# Altium project PCB_Project_3.PrjPcb
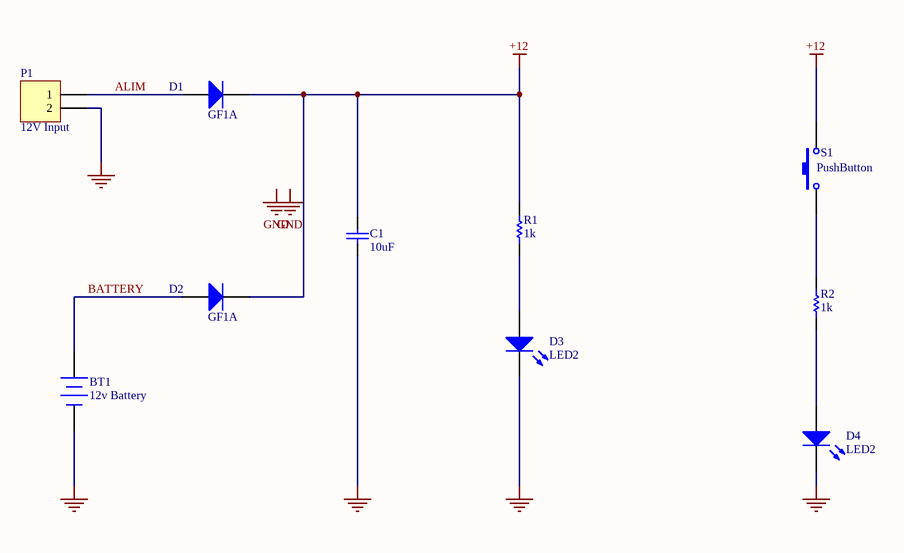
[diagram p0: dechire.SchDoc]
1 sheet, 10 parts. Net scope: global (net labels, ports and power ports of the same name join across sheets).

## Sheet dechire.SchDoc
size A

### Parts
BT1  12v Battery  [BAT-2]
C1  10uF  [RAD-0.3]
D1  GF1A  [SMC]
D2  GF1A  [SMC]
D3  LED2  [LED-1]
D4  LED2  [LED-1]
P1  12V Input  [HDR1X2]
R1  1k  [AXIAL-0.3]
R2  1k  [AXIAL-0.3]
S1  PushButton  [SPST-2]

### Nets
+12: C1.2 D1.2(K) D2.2(K) R1.2 S1.2
GND: BT1.2(-) C1.1 D3.2(K) D4.2(K) P1.2
ALIM: D1.1(A) P1.1
BATTERY: BT1.1(+) D2.1(A)
NetD3_1: D3.1(A) R1.1
NetD4_1: D4.1(A) R2.1
NetR2_2: R2.2 S1.1

### Notes on the sheet
- Labels drawn without touching a wire or pin: GND

### Library data of the parts
BT1 = Battery: Multicell Battery; Fabricant: .; Published: 24-Mar-1999; LatestRevisionDate: 17-Jul-2002; LatestRevisionNote: Re-released for DXP Platform.; PackageReference: BAT-2; Publisher: Altium Limited; PackageDescription: Battery; 2 Leads
C1 = Cap: Capacitor; Fabricant: .; Published: 8-Jun-2000; LatestRevisionDate: 17-Jul-2002; LatestRevisionNote: Re-released for DXP Platform.; PackageReference: RAD-0.3; Publisher: Altium Limited; PackageDescription: Radial Cap, Thru-Hole; 2 Leads; 0.3 in Pin Spacing; Value: 10uF
D1 D2 = Diode: Default Diode; Fabricant: .; Published: 8-Jun-2000; LatestRevisionDate: 17-Jul-2002; LatestRevisionNote: Re-released for DXP Platform.; PackageVersion: Sep-1996; PackageReference: SMC; Publisher: Altium Limited; PackageDescription: DO-214-AB/SMC; 2 C-Bend Leads; Body 7.9 x 5.9 mm, inc. leads (LxW); Code_JEDEC: DO-214-AB
D3 D4 = LED1: Typical RED GaAs LED; Fabricant: .; Published: 8-Jun-2000; LatestRevisionDate: 08-Jul-2005; LatestRevisionNote: Mech Layer 1 removed.; PackageReference: LED-1; Publisher: Altium Limited; PackageDescription: LED; 2 Leads
P1 = Header 2: Header, 2-Pin; Fabricant: .; LatestRevisionDate: 17-Jul-2002; LatestRevisionNote: Re-released for DXP Platform.; Publisher: Altium Limited
R1 R2 = Res1: Resistor; Fabricant: .; Published: 8-Jun-2000; LatestRevisionDate: 17-Jul-2002; LatestRevisionNote: Re-released for DXP Platform.; PackageReference: AXIAL-0.3; Publisher: Altium Limited; PackageDescription: Axial Device, Thru-Hole; 2 Leads; 0.3 in Pin Spacing; Value: 1K
S1 = SW-PB: Switch; Fabricant: .; Published: 24-Mar-1999; LatestRevisionDate: 17-Jul-2002; LatestRevisionNote: Re-released for DXP Platform.; PackageReference: SPST-2; Publisher: Altium Limited; PackageDescription: Switch; 2 Leads